# Altium schematic sheet MainBoard.SchDoc
size A4
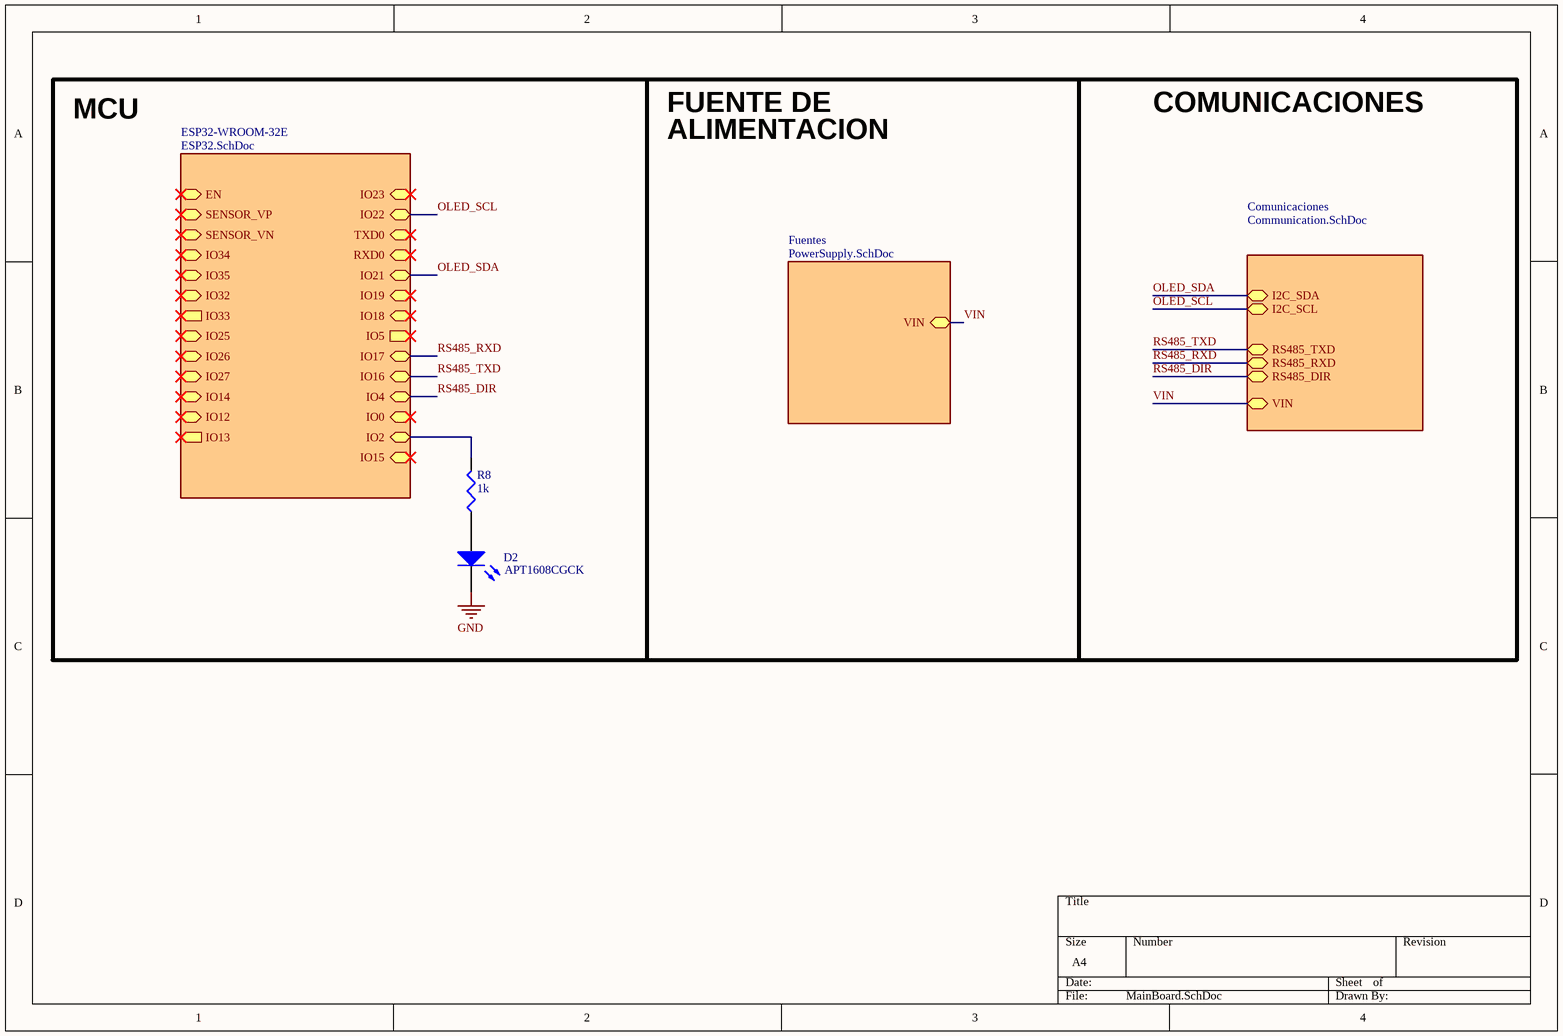
[diagram p0: MainBoard.SchDoc]

## Parts
D2  APT1608CGCK  [ChipDiode1608]
R8  1k  [RESC2012N]

## Sub-sheets
Comunicaciones = Communication.SchDoc: I2C_SDA, I2C_SCL, VIN, RS485_DIR, RS485_RXD, RS485_TXD
ESP32-WROOM-32E = ESP32.SchDoc: SENSOR_VN, IO34, SENSOR_VP, IO35, IO32, IO33 (out), IO25, IO26, IO27, IO14, IO12, IO13 (out), IO22, TXD0, RXD0, IO15, IO23, IO21, IO19, IO18, IO5 (out), IO17, IO16, IO4, IO0, IO2, EN
Fuentes = PowerSupply.SchDoc: VIN

## Nets
GND: D2.2(K)
OLED_SCL: sheet ESP32-WROOM-32E/IO22, sheet Comunicaciones/I2C_SCL
OLED_SDA: sheet ESP32-WROOM-32E/IO21, sheet Comunicaciones/I2C_SDA
RS485_DIR: sheet ESP32-WROOM-32E/IO4, sheet Comunicaciones/RS485_DIR
RS485_RXD: sheet ESP32-WROOM-32E/IO17, sheet Comunicaciones/RS485_RXD
RS485_TXD: sheet ESP32-WROOM-32E/IO16, sheet Comunicaciones/RS485_TXD
VIN: sheet Fuentes/VIN, sheet Comunicaciones/VIN
NetD2_1: D2.1(A) R8.1
NetR8_2: R8.2 ; sheet ESP32-WROOM-32E/IO2

## Notes on the sheet
- FUENTE DE
- COMUNICACIONES
- MCU
- ALIMENTACION

## Library data of the parts
D2 = LED2: LED 1.6x0.8 mm 570 nm GRN CLR SMD; Published: 8-Jun-2000; LatestRevisionDate: 17-Jul-2002; LatestRevisionNote: Re-released for DXP Platform.; PackageVersion: Feb-2002; PackageReference: 3.2X1.6X1.1; Publisher: Altium Limited; PackageDescription: SM LED; 2 Flat Leads
R8 = Res3: Resistor; Published: 8-Jun-2000; LatestRevisionDate: 29-May-2009; LatestRevisionNote: IPC-7351 Footprint Added.; PackageReference: J1-0603; Publisher: Altium Limited; PackageDescription: Chip Resistor; Value: 1K